# EasyEDA schematic SCH_Forhorse_acw02_esphome_v2_2026-06-07.json
TITLE: ACW02 ESPHome; REV: 2.0; Date: 2026-02-06; Sheet: 1/1; Drawn By: Forhorse; Company: Your Company
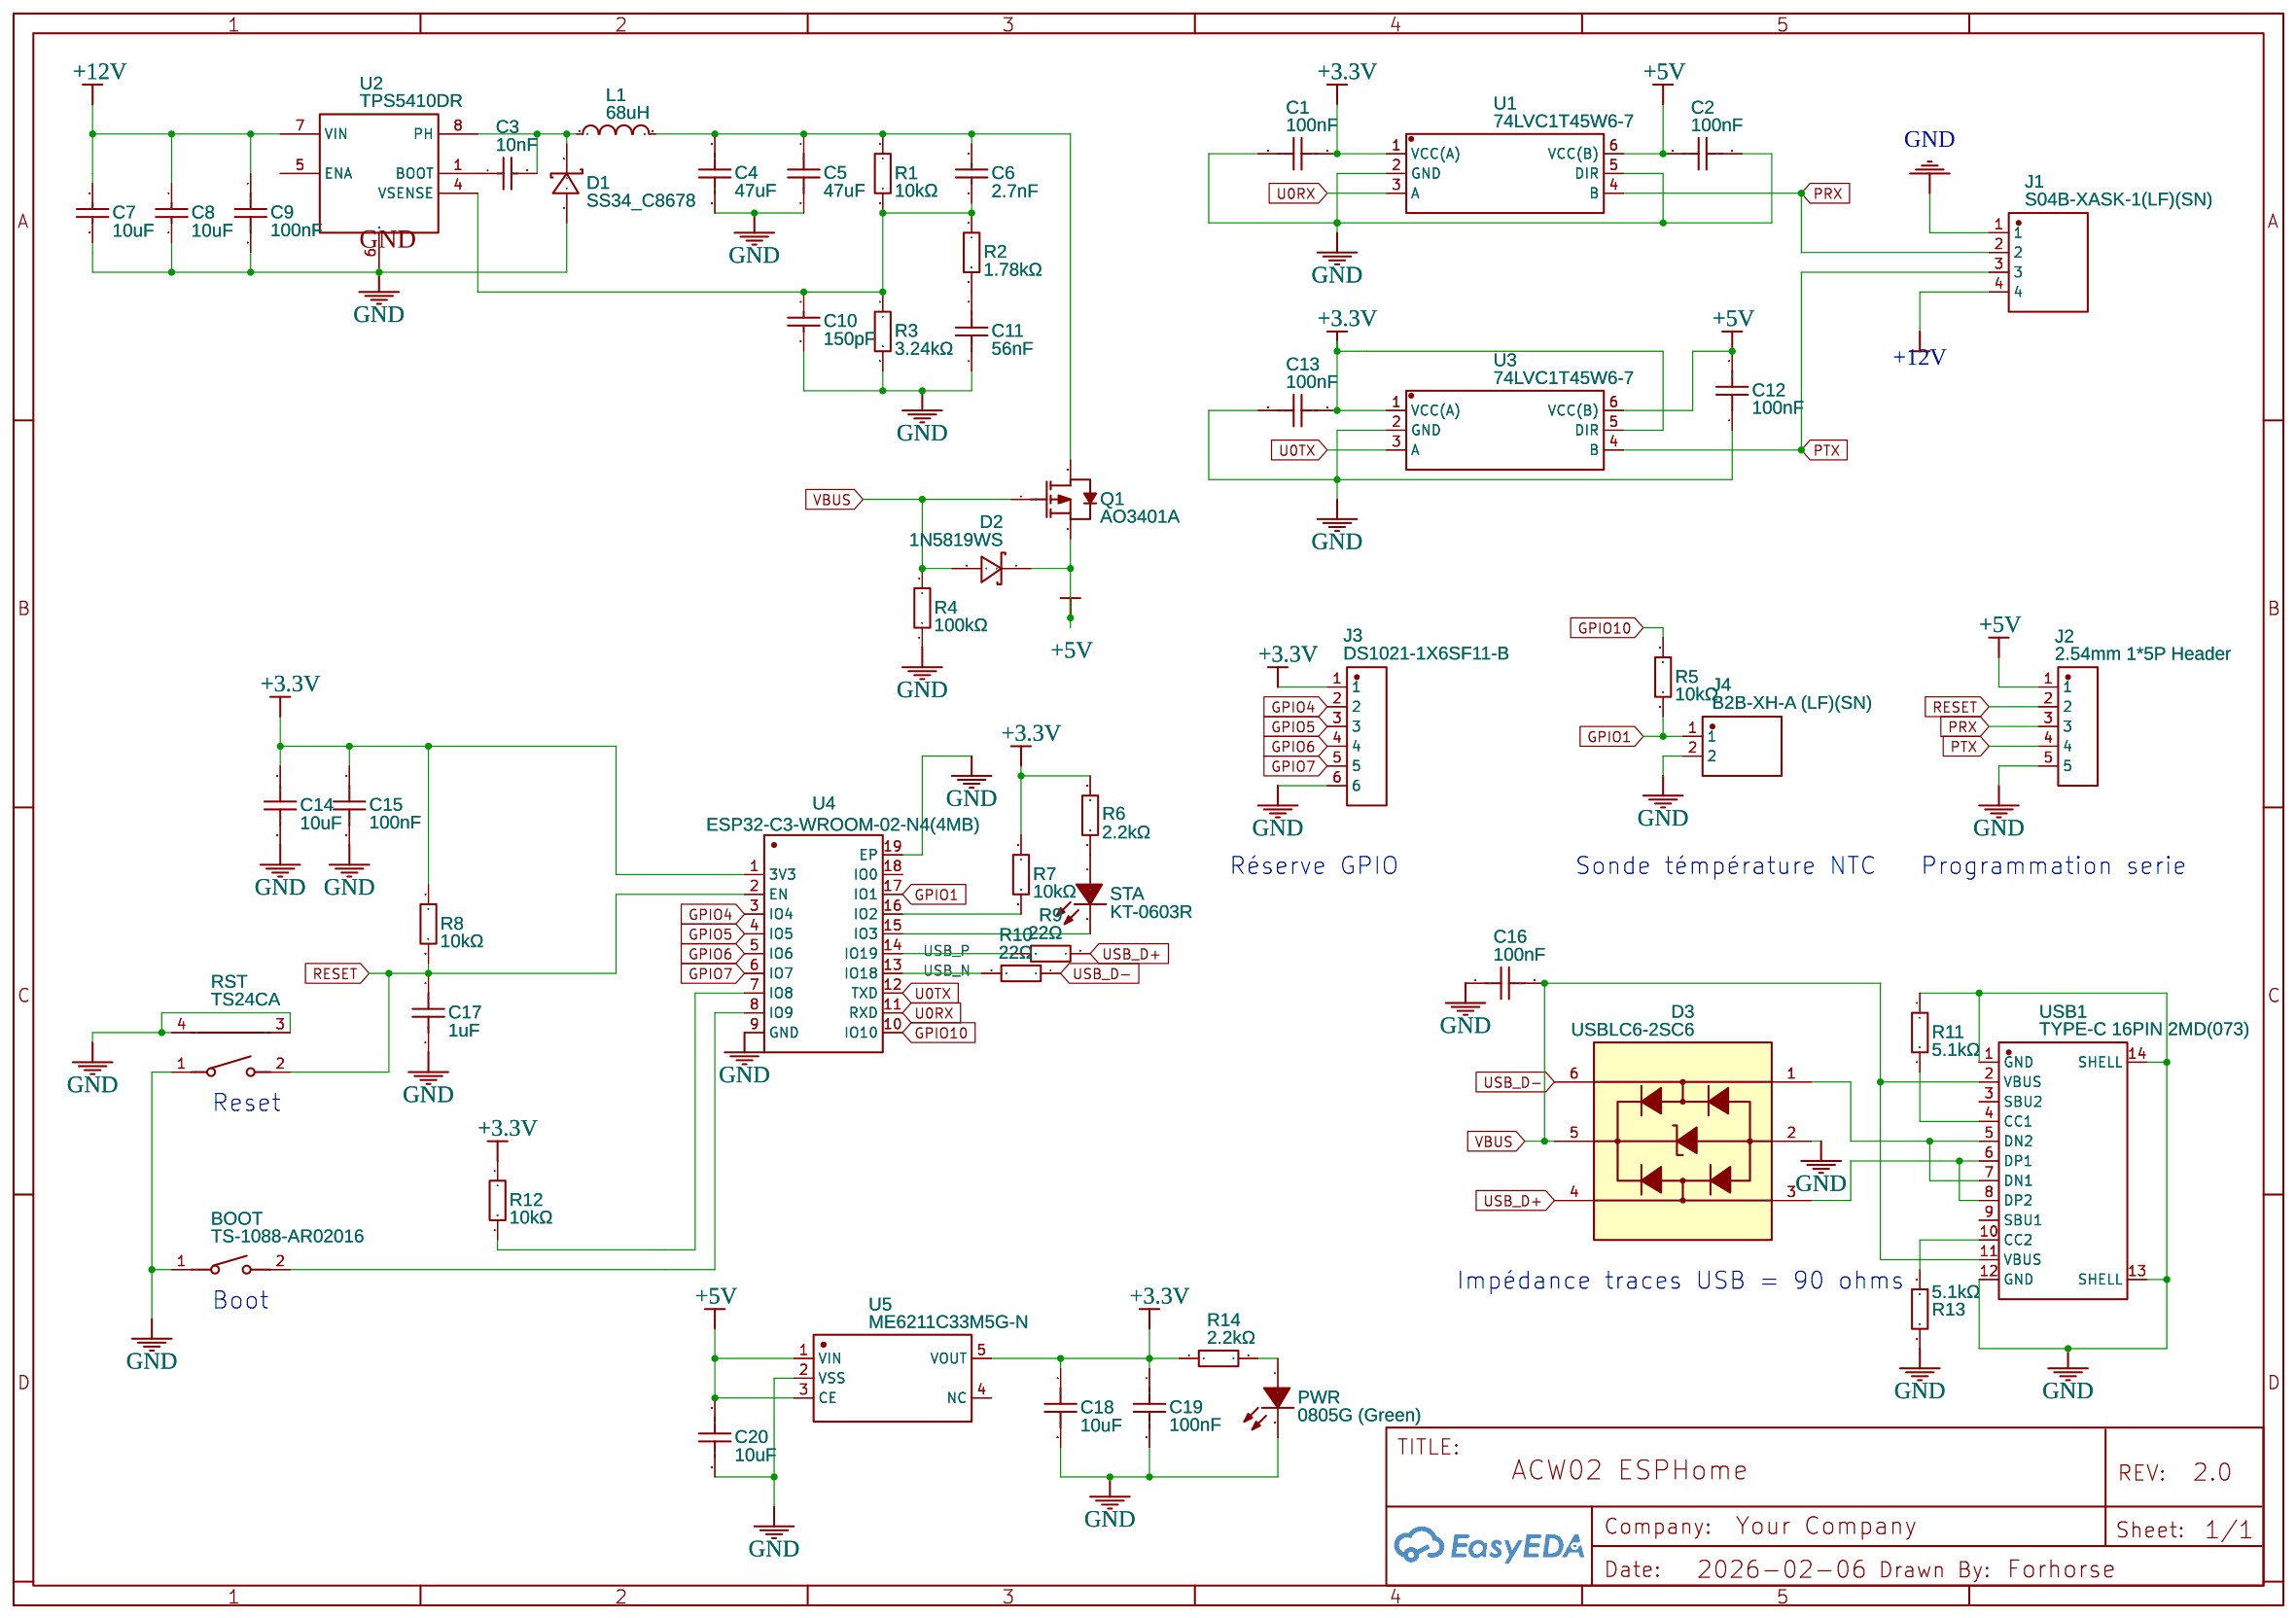
[diagram p0: schematic sheet]

## Parts
BOOT  TS-1088-AR02016  [SW-SMD_L3.9-W3.0-P4.45]
C1  100nF  [C0402]
C2  100nF  [C0402]
C3  10nF  [C0603]
C4  47uF  [C1206]
C5  47uF  [C1206]
C6  2.7nF  [C0603]
C7  10uF  [C1206]
C8  10uF  [C1206]
C9  100nF  [C0402]
C10  150pF  [C0603]
C11  56nF  [C0603]
C12  100nF  [C0402]
C13  100nF  [C0402]
C14  10uF  [C0603]
C15  100nF  [C0402]
C16  100nF  [C0402]
C17  1uF  [C0603]
C18  10uF  [C0603]
C19  100nF  [C0402]
C20  10uF  [C0603]
D1  SS34_C8678  [SMA_L4.3-W2.6-LS5.2-RD]
D2  1N5819WS  [SOD-323_L1.8-W1.3-LS2.5-RD]
D3  USBLC6-2SC6  [SOT-23-6_L2.9-W1.6-P0.95-LS2.8-BL]
J1  S04B-XASK-1(LF)(SN)  [CONN-TH_S04B-XASK-1-LF-SN]
J2  2.54mm 1*5P Header  [HDR-TH_5P-P2.54-V-M]
J3  DS1021-1X6SF11-B  [CONN-TH_DS1021-1X6SF11-B]
J4  B2B-XH-A (LF)(SN)  [CONN-TH_B2B-XH-A-LF-SN]
L1  68uH  [IND-SMD_L4.0-W4.0_FNR40XXS]
PWR  0805G (Green)  [LED0805-R-RD]
Q1  AO3401A  [SOT-23_L2.9-W1.3-P1.90-LS2.4-BR]
R1  10kΩ  [R0603]
R2  1.78kΩ  [R0603]
R3  3.24kΩ  [R0603]
R4  100kΩ  [R0603]
R5  10kΩ  [R0603]
R6  2.2kΩ  [R0603]
R7  10kΩ  [R0603]
R8  10kΩ  [R0603]
R9  22Ω  [R0603]
R10  22Ω  [R0603]
R11  5.1kΩ  [R0603]
R12  10kΩ  [R0603]
R13  5.1kΩ  [R0603]
R14  2.2kΩ  [R0603]
RST  TS24CA  [SW-SMD_2P-TS24CA]
STA  KT-0603R  [LED0603-RD]
U1  74LVC1T45W6-7  [SOT-23-6_L2.9-W1.6-P0.95-LS2.8-BR]
U2  TPS5410DR  [SOIC-8_L5.0-W4.0-P1.27-LS6.0-BL]
U3  74LVC1T45W6-7  [SOT-23-6_L2.9-W1.6-P0.95-LS2.8-BR]
U4  ESP32-C3-WROOM-02-N4(4MB)  [BULETM-SMD_ESPRESSIF_ESP32-C3-WROOM-02-N4-4MB]
U5  ME6211C33M5G-N  [SOT-23-5_L3.0-W1.7-P0.95-LS2.8-BL]
USB1  TYPE-C 16PIN 2MD(073)  [USB-C-SMD_TYPE-C-6PIN-2MD-073]

## Library data of the parts
BOOT = TS-1088-AR02016: Contributor: LCSC; Supplier: LCSC; Supplier Part: C720477; Manufacturer: XUNPU(讯普); JLCPCB Part Class: Basic Part
C1 C2 C12 C13 C15 C16 C19 = CL05B104KO5NNNC: Supplier: LCSC; Manufacturer: SAMSUNG(三星); Supplier Part: C1525; JLCPCB Part Class: Basic Part
C3 = 0603B103K500NT: Supplier: LCSC; Manufacturer: FH(风华); Supplier Part: C57112; JLCPCB Part Class: Basic Part
C4 C5 = CL31A476MPHNNNE: Supplier: LCSC; Manufacturer: SAMSUNG(三星); Supplier Part: C96123; JLCPCB Part Class: Basic Part
C6 = GRM1885C1H272JA01D: Supplier: LCSC; Manufacturer: muRata(村田); Supplier Part: C77034; JLCPCB Part Class: Extended Part
C7 C8 = CL31A106KBHNNNE: Supplier: LCSC; Manufacturer: SAMSUNG(三星); Supplier Part: C13585; JLCPCB Part Class: Basic Part
C9 = CL05B104KB54PNC: Contributor: LCSC; Supplier: LCSC; Supplier Part: C307331; Manufacturer: SAMSUNG(三星); JLCPCB Part Class: Basic Part
C10 = 0603B151K500NT: Supplier: LCSC; Manufacturer: FH(风华); Supplier Part: C1594; JLCPCB Part Class: Basic Part
C11 = CC0603KRX7R9BB563: Contributor: LCSC; Supplier: LCSC; Supplier Part: C282072; Manufacturer: YAGEO(国巨); JLCPCB Part Class: Extended Part
C14 C18 C20 = CL10A106KP8NNNC: Supplier: LCSC; Manufacturer: SAMSUNG(三星); Supplier Part: C19702; JLCPCB Part Class: Basic Part
C17 = CL10A105KB8NNNC: Supplier: LCSC; Manufacturer: SAMSUNG(三星); Supplier Part: C15849; JLCPCB Part Class: Basic Part
D1 = SS34_C8678: Supplier: LCSC; Manufacturer Part: SS34; Manufacturer: MDD(辰达半导体); Supplier Part: C8678; JLCPCB Part Class: Basic Part
D2 = 1N5819WS: Contributor: LCSC; Supplier: LCSC; Supplier Part: C191023; Manufacturer: Hottech(合科泰); JLCPCB Part Class: Basic Part
D3 = USBLC6-2SC6: Supplier: LCSC; Manufacturer: ST(意法半导体); Supplier Part: C7519; JLCPCB Part Class: Extended Part
J1 = S04B-XASK-1(LF)(SN): Contributor: LCSC; Supplier: LCSC; Supplier Part: C265097; Manufacturer: JST; JLCPCB Part Class: Extended Part
J2 = 2.54mm 1*5P Header: Supplier Part: C50951; Supplier: LCSC; Manufacturer: ReliaPro
J3 = DS1021-1X6SF11-B: Supplier: LCSC; Supplier Part: C7430362; Manufacturer: CONNFLY; Manufacturer Part: DS1021-1x6SF11-B; Contributor: lcsc; JLCPCB Part Class: Extended Part
J4 = B2B-XH-A (LF)(SN): Contributor: LCSC; Supplier: LCSC; Supplier Part: C158012; Manufacturer: JST; Manufacturer Part: B2B-XH-A(LF)(SN); JLCPCB Part Class: Extended Part
L1 = FNR4030S680MT: Contributor: LCSC; Supplier: LCSC; Manufacturer: cjiang(长江微电); Supplier Part: C167892; JLCPCB Part Class: Extended Part
PWR = 0805G (Green): Supplier: LCSC; Manufacturer: KENTO; Manufacturer Part: KT-0805G; Supplier Part: C2297; JLCPCB Part Class: Basic Part
Q1 = AO3401A: Supplier: LCSC; Manufacturer: AOS; Supplier Part: C15127; JLCPCB Part Class: Basic Part
R1 R5 R7 R8 R12 = 0603WAF1002T5E: Supplier: LCSC; Manufacturer: UNI-ROYAL(厚声); Supplier Part: C25804; JLCPCB Part Class: Basic Part
R2 = 0603WAF1781T5E: Supplier: LCSC; Manufacturer: UNI-ROYAL(厚声); Supplier Part: C22849; JLCPCB Part Class: Extended Part
R3 = 0603WAF3241T5E: Supplier: LCSC; Manufacturer: UNI-ROYAL(厚声); Supplier Part: C22994; JLCPCB Part Class: Extended Part
R4 = 0603WAF1003T5E: Supplier: LCSC; Manufacturer: UNI-ROYAL(厚声); Supplier Part: C25803; JLCPCB Part Class: Basic Part
R6 R14 = 0603WAF2201T5E: Supplier: LCSC; Manufacturer: UNI-ROYAL(厚声); Supplier Part: C4190; JLCPCB Part Class: Basic Part
R9 R10 = 0603WAF220JT5E: Supplier: LCSC; Manufacturer: UNI-ROYAL(厚声); Supplier Part: C23345; JLCPCB Part Class: Basic Part
R11 R13 = 0603WAF5101T5E: Supplier: LCSC; Manufacturer: UNI-ROYAL(厚声); Supplier Part: C23186; JLCPCB Part Class: Basic Part
RST = TS24CA: Contributor: LCSC; Supplier: LCSC; Supplier Part: C393942; Manufacturer: SHOU HAN(首韩); JLCPCB Part Class: Extended Part
STA = KT-0603R: Supplier: LCSC; Manufacturer: KENTO; Supplier Part: C2286; JLCPCB Part Class: Basic Part
U1 U3 = 74LVC1T45W6-7: Contributor: LCSC; Supplier: LCSC; Supplier Part: C168856; Manufacturer: DIODES(美台); JLCPCB Part Class: Extended Part
U2 = TPS5410DR: tags: DC/DC Switching Regulator; subpart_no: 1; image: http://image.lceda.cn/szlcsc/C28867.jpg; Supplier Part: C28867; Supplier: LCSC; Manufacturer: TI(德州仪器); JLCPCB Part Class: Extended Part
U4 = ESP32-C3-WROOM-02-N4(4MB): Contributor: LCSC; Supplier: LCSC; Supplier Part: C2934560; Manufacturer: ESPRESSIF(乐鑫); Manufacturer Part: ESP32-C3-WROOM-02-N4; JLCPCB Part Class: Extended Part
U5 = ME6211C33M5G-N: Supplier: LCSC; Manufacturer: MICRONE(南京微盟); Supplier Part: C82942; JLCPCB Part Class: Extended Part
USB1 = TYPE-C 16PIN 2MD(073): Contributor: LCSC; Supplier: LCSC; Supplier Part: C2765186; Manufacturer: SHOU HAN(首韩); JLCPCB Part Class: Extended Part

## Nets
+3.3V: C1.1 C13.1 C14.1 C15.1 C18.1 C19.1 J3.1 R6.2 R7.1 R8.1 R12.1 R14.1 U1.1(VCC(A)) U3.1(VCC(A)) U3.5(DIR) U4.1(3V3) U5.5(VOUT)
+5V: C2.2 C12.2 C20.1 D2.1(K) J2.1 Q1.2(S) U1.6(VCC(B)) U3.6(VCC(B)) U5.1(VIN) U5.3(CE)
+12V: C7.1 C8.1 C9.1 J1.4 U2.7(VIN)
GND: BOOT.1 C1.2 C2.1 C4.2 C5.2 C7.2 C8.2 C9.2 C10.2 C11.1 C12.1 C13.2 C14.2 C15.2 C16.1 C17.2 C18.2 C19.2 C20.2 D1.2(A) D3.2 J1.1 J2.5 J3.6 J4.2 PWR.2(K) R3.2 R4.2 R11.1 R13.2 RST.1 RST.3 RST.4 U1.2(GND) U1.5(DIR) U2.6(GND) U3.2(GND) U4.9(GND) U4.19(EP) U5.2(VSS) USB1.1(GND) USB1.12(GND) USB1.13(SHELL) USB1.14(SHELL)
VBUS: C16.2 D2.2(A) D3.5 Q1.1(G) R4.1 USB1.2(VBUS) USB1.11(VBUS)
GPIO1: J4.1 R5.2 U4.17(IO1)
GPIO4: J3.2 U4.3(IO4)
GPIO5: J3.3 U4.4(IO5)
GPIO6: J3.4 U4.5(IO6)
GPIO7: J3.5 U4.6(IO7)
GPIO10: R5.1 U4.10(IO10)
PRX: J1.2 J2.3 U1.4(B)
PTX: J1.3 J2.4 U3.4(B)
RESET: C17.1 J2.2 R8.2 RST.2 U4.2(EN)
U0RX: U1.3(A) U4.11(RXD)
U0TX: U3.3(A) U4.12(TXD)
USB_D+: D3.4 R9.1
USB_D-: D3.6 R10.1
USB_N: R10.2 U4.13(IO18)
USB_P: R9.2 U4.14(IO19)
Net-(BOOT-2): BOOT.2 U4.8(IO9)
Net-(C3-1): C3.1 U2.1(BOOT)
Net-(C3-2): C3.2 D1.1(K) L1.1 U2.8(PH)
Net-(C4-1): C4.1 C5.1 C6.1 L1.2 Q1.3(D) R1.1
Net-(C6-2): C6.2 C10.1 R1.2 R2.1 R3.1 U2.4(VSENSE)
Net-(C11-2): C11.2 R2.2
Net-(D3-1): D3.1 USB1.5(DN2) USB1.7(DN1)
Net-(D3-3): D3.3 USB1.6(DP1) USB1.8(DP2)
Net-(PWR-1): PWR.1(A) R14.2
Net-(R6-1): R6.1 STA.2(A)
Net-(R7-2): R7.2 U4.16(IO2)
Net-(R11-2): R11.2 USB1.4(CC1)
Net-(R12-2): R12.2 U4.7(IO8)
Net-(R13-1): R13.1 USB1.10(CC2)
Net-(STA-1): STA.1(K) U4.15(IO3)

Not connected (* = marked no-connect by the designer): U2 5(ENA); U4 18(IO0); U5 4(NC); USB1 3(SBU2) 9(SBU1)

## Notes on the sheet
- Réserve GPIO
- Sonde témpérature NTC
- Programmation serie
- Reset
- Impédance traces USB = 90 ohms
- Boot
